# Altium schematic sheet sch_driver.SchDoc: Pilote du Moteur
size A4; CheckedBy: Q.V. Nguyen; Author: Q.V. Nguyen, C. Demasson; DrawnBy: Q.V. Nguyen, C. Demasson; Organization: CNES; DocumentNumber: 1; Revision: 0; SheetNumber: 4; SheetTotal: 4; ProjectName: EYE-SAT
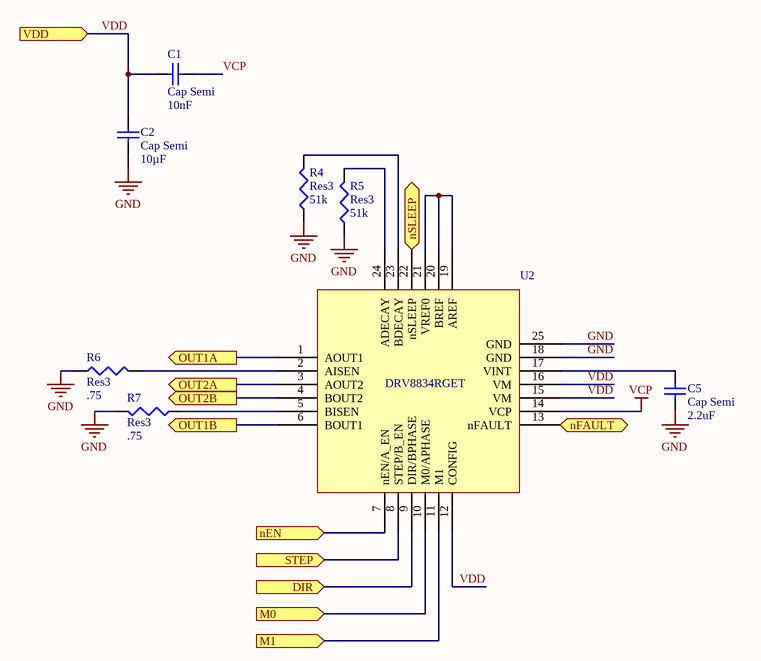
[diagram p0: sch_driver.SchDoc]

## Parts
C1  Cap Semi  value 10nF  [C1206]
C2  Cap Semi  value 10µF  [C1206]
C5  Cap Semi  value 2.2uF  [C1206]
R4  Res3  value 51k  [C1206]
R5  Res3  value 51k  [C1206]
R6  Res3  value .75  [C1206]
R7  Res3  value .75  [C1206]
U2  DRV8834RGET  [QFN24]

## Ports
DIR (in), M0 (in), M1 (in), nEN (in), nFAULT (out), nSLEEP (in), OUT1A (out), OUT1B (out), OUT2A (out), OUT2B (out), STEP (in), VDD (in)

## Nets
GND: C2.2 C5.1 R4.1 R5.1 R6.1 R7.2 U2.18(GND) U2.25(GND)
VCP: C1.1 U2.14(VCP)
DIR: U2.9(DIR/BPHASE) ; port DIR
M0: U2.10(M0/APHASE) ; port M0
M1: U2.11(M1) ; port M1
nEN: U2.7(nEN/A_EN) ; port nEN
nFAULT: U2.13(nFAULT) ; port nFAULT
nSLEEP: U2.22(nSLEEP) ; port nSLEEP
OUT1A: U2.1(AOUT1) ; port OUT1A
OUT1B: U2.6(BOUT1) ; port OUT1B
OUT2A: U2.3(AOUT2) ; port OUT2A
OUT2B: U2.4(BOUT2) ; port OUT2B
STEP: U2.8(STEP/B_EN) ; port STEP
VDD: C1.2 C2.1 U2.12(CONFIG) U2.15(VM) U2.16(VM) ; port VDD
NetC5_2: C5.2 U2.17(VINT)
NetR4_2: R4.2 U2.23(BDECAY)
NetR5_2: R5.2 U2.24(ADECAY)
NetR6_2: R6.2 U2.2(AISEN)
NetR7_1: R7.1 U2.5(BISEN)
NetU2_19: U2.19(AREF) U2.20(BREF) U2.21(VREF0)

## Notes on the sheet
- Title
- Size:
- Date:
- A4
- Number:
- Revision:
- Sheet
- of
- Drawn by:
- Approved by:

## Library data of the parts
C1 C2 C5 = Cap Semi: Capacitor (Semiconductor SIM Model); Published: 8-Jun-2000; LatestRevisionDate: 29-May-2009; LatestRevisionNote: IPC-7351 Footprint Added.; PackageReference: C1206; Publisher: Altium Limited; PackageDescription: Chip Capacitor
R4-R7 = Res3: Resistor; Published: 8-Jun-2000; LatestRevisionDate: 29-May-2009; LatestRevisionNote: IPC-7351 Footprint Added.; PackageReference: J1-0603; Publisher: Altium Limited; PackageDescription: Chip Resistor